# EAGLE design EE192_Sp17_Team01_combo (EAGLE 8.0.1)

## Sheet 1 of 4
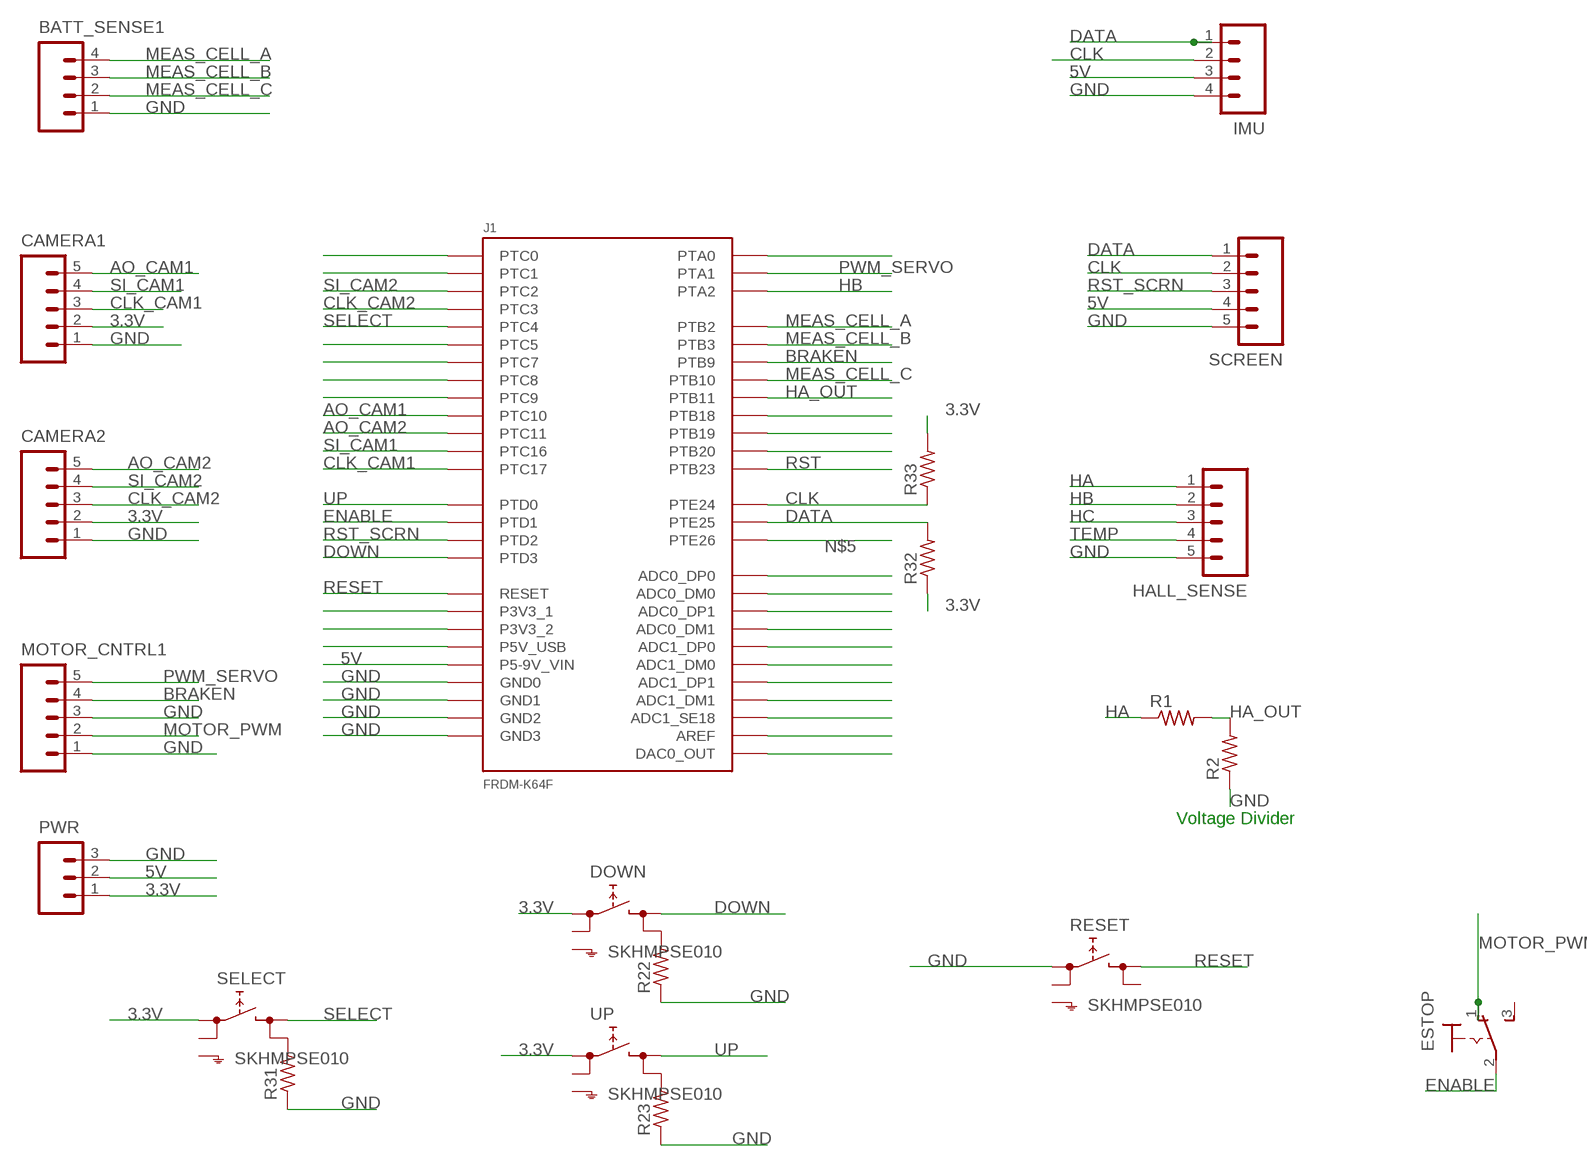
[diagram p0: schematic, sheet 1]

### Parts
BATT_SENSE1  M041X04-MTA  [1X04-MTA]
CAMERA1  M05MTA  [1X05-MTA]
CAMERA2  M05MTA  [1X05-MTA]
DOWN  SKHMPSE010  [SKHMPXE010]
ESTOP  320-916  [320-916]
HALL_SENSE  M05MTA  [1X05-MTA]
IMU  M041X04-MTA  [1X04-MTA]
J1  FRDM-K64F  [FRDM-K64F]
MOTOR_CNTRL1  M05MTA  [1X05-MTA]
PWR  M031X03-MTA  [1X03-MTA]
R1  R-US_R0805  [R0805]
R2  R-US_R0805  [R0805]
R22  R-US_R0805  [R0805]
R23  R-US_R0805  [R0805]
R31  R-US_R0805  [R0805]
R32  R-US_R0805  [R0805]
R33  R-US_R0805  [R0805]
RESET  SKHMPSE010  [SKHMPXE010]
SCREEN  M05MTA  [1X05-MTA]
SELECT  SKHMPSE010  [SKHMPXE010]
UP  SKHMPSE010  [SKHMPXE010]

### Nets
3.3V: CAMERA1.2 CAMERA2.2 DOWN.1(1.1) PWR.1 R32.1 R33.2 SELECT.1(1.1) UP.1(1.1)
5V: IMU.3 J1.J3-16(P5-9V_VIN) PWR.2 SCREEN.4
AO_CAM1: CAMERA1.5 J1.J4-12(PTC10)
AO_CAM2: CAMERA2.5 J1.J4-10(PTC11)
BRAKEN: J1.J1-6(PTB9) MOTOR_CNTRL1.4 ; also sheet 4
CLK: IMU.2 J1.J2-20(PTE24) R33.1 SCREEN.2
CLK_CAM1: CAMERA1.3 J1.J1-4(PTC17)
CLK_CAM2: CAMERA2.3 J1.J1-16(PTC3)
DATA: IMU.1 J1.J2-18(PTE25) R32.2 SCREEN.1
DOWN: DOWN.3(2.1) J1.J2-10(PTD3)
ENABLE: ESTOP.2(P) J1.J2-12(PTD1) ; also sheet 4
GND: BATT_SENSE1.1 CAMERA1.1 CAMERA2.1 HALL_SENSE.5 IMU.4 J1.J2-3(GND0) J1.J2-14(GND1) J1.J3-12(GND2) J1.J3-14(GND3) MOTOR_CNTRL1.1 MOTOR_CNTRL1.3 PWR.3 R2.1 R22.1 R23.1 R31.1 RESET.1(1.1) SCREEN.5 ; also sheet 3,4
HA: HALL_SENSE.1 R1.1 ; also sheet 4
HA_OUT: J1.J4-8(PTB11) R1.2 R2.2
HB: HALL_SENSE.2 J1.J1-12(PTA2) ; also sheet 4
HC: HALL_SENSE.3 ; also sheet 4
MEAS_CELL_A: BATT_SENSE1.4 J1.J4-2(PTB2) ; also sheet 3
MEAS_CELL_B: BATT_SENSE1.3 J1.J4-4(PTB3) ; also sheet 3
MEAS_CELL_C: BATT_SENSE1.2 J1.J4-6(PTB10) ; also sheet 3
MOTOR_PWM: ESTOP.1(O) MOTOR_CNTRL1.2
N$3: J1.J2-7(ADC0_DM0)
N$5: J1.J2-1(PTE26)
N$8: J1.J4-1(ADC0_DP1)
N$9: J1.J1-11(PTC0)
N$11: J1.J1-5(PTC1)
N$15: J1.J1-15(PTC5)
N$16: J1.J1-13(PTC7)
N$17: J1.J1-7(PTC8)
N$18: J1.J1-9(PTC9)
N$19: J1.J2-2(PTA0)
N$20: J1.J1-3(PTB19)
N$21: J1.J3-4(P3V3_1)
N$23: J1.J3-8(P3V3_2)
N$24: J1.J3-10(P5V_USB)
N$25: J1.J4-3(ADC0_DM1)
N$28: J1.J2-11(ADC1_DP0)
N$29: J1.J2-13(ADC1_DM0)
N$30: J1.J4-5(ADC1_DP1)
N$31: J1.J4-7(ADC1_DM1)
N$33: J1.J2-17(ADC1_SE18)
N$34: J1.J2-16(AREF)
N$36: J1.J4-11(DAC0_OUT)
N$37: J1.J4-9(PTB20)
N$41: R31.2 SELECT.4(2.2)
N$42: R23.2 UP.4(2.2)
N$43: DOWN.4(2.2) R22.2
N$44: J1.J2-5(ADC0_DP0)
N$45: J1.J1-1(PTB18)
PWM_SERVO: J1.J1-8(PTA1) MOTOR_CNTRL1.5 ; also sheet 4
RESET: J1.J3-6(RESET) RESET.3(2.1)
RST: J1.J1-10(PTB23)
RST_SCRN: J1.J2-8(PTD2) SCREEN.3
SELECT: J1.J2-4(PTC4) SELECT.3(2.1)
SI_CAM1: CAMERA1.4 J1.J1-2(PTC16)
SI_CAM2: CAMERA2.4 J1.J1-14(PTC2)
TEMP: HALL_SENSE.4 ; also sheet 4
UP: J1.J2-6(PTD0) UP.3(2.1)
Unconnected: DOWN.2(1.2) DOWN.5(SH) ESTOP.3(S) RESET.2(1.2) RESET.4(2.2) RESET.5(SH) SELECT.2(1.2) SELECT.5(SH) UP.2(1.2) UP.5(SH)

### Notes on the sheet
- Voltage Divider

## Sheet 2 of 4

## Sheet 3 of 4
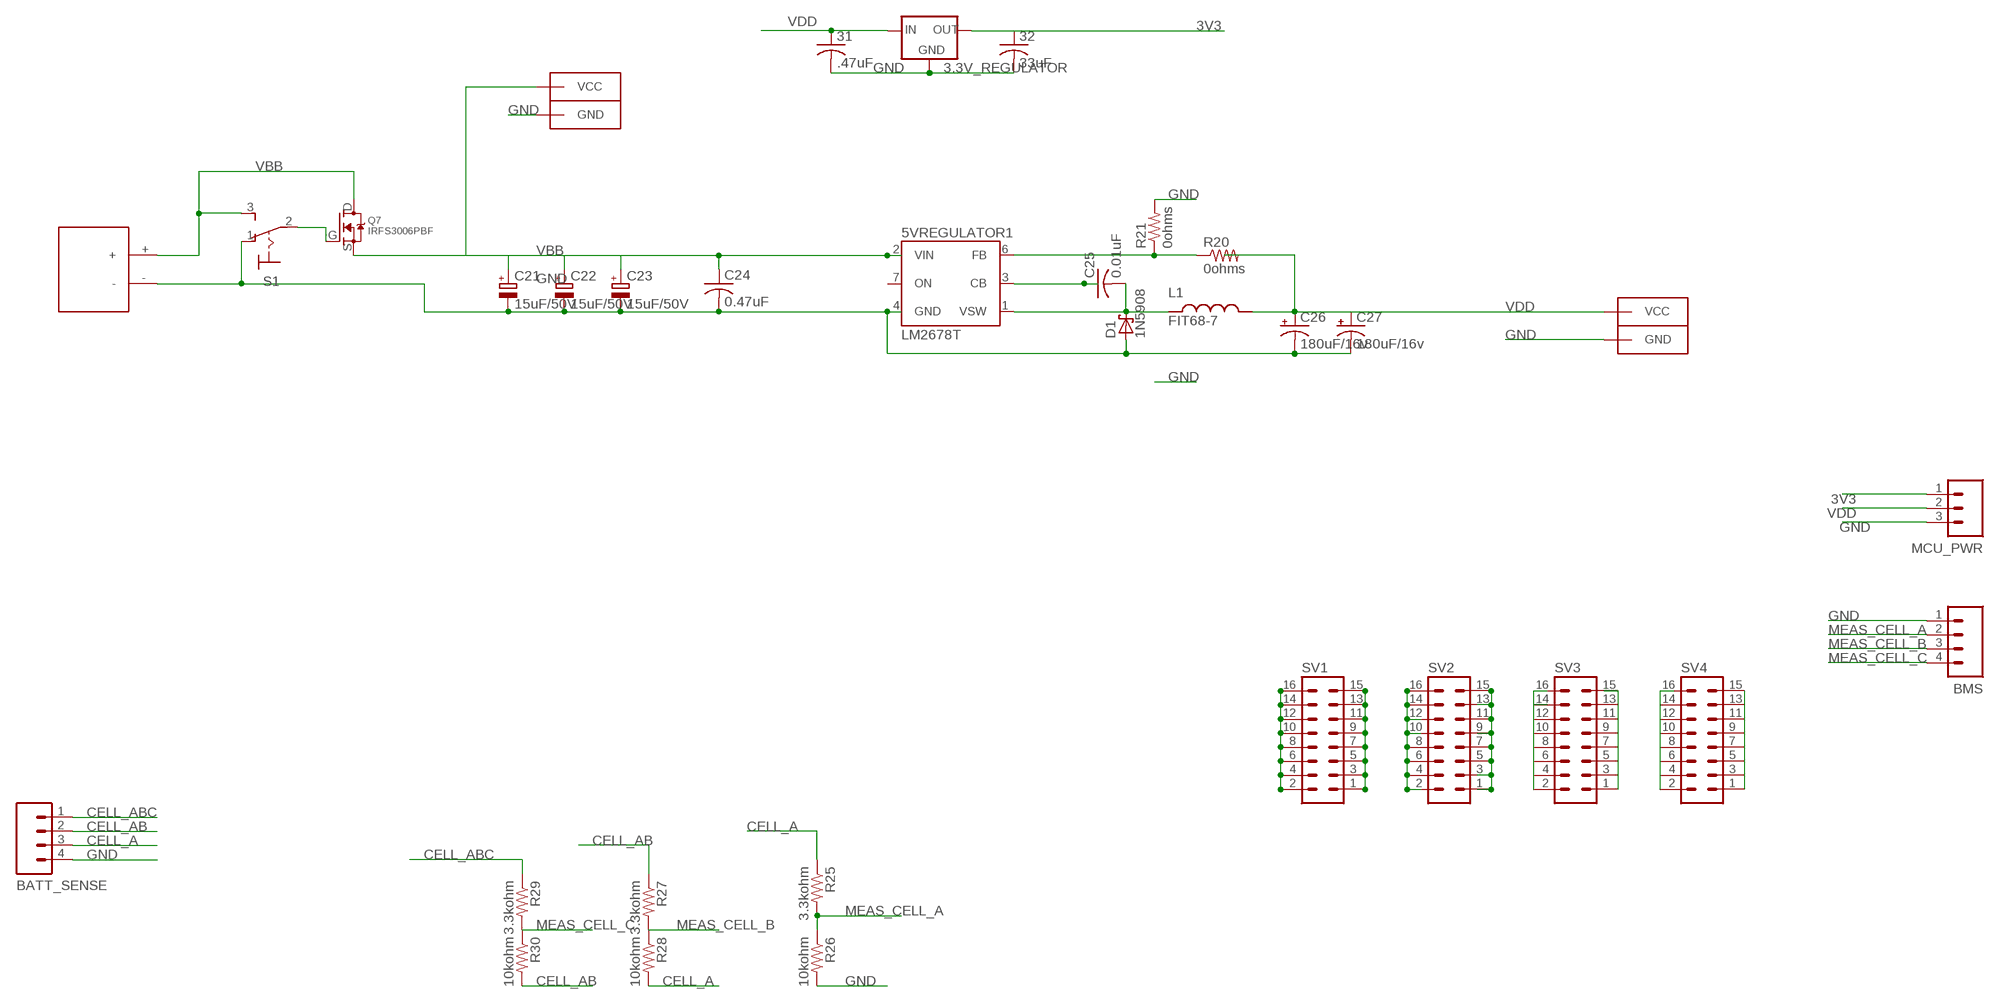
[diagram p1: schematic, sheet 3]

### Parts
3.3V_REGULATOR  78MXXL  [78MXXL]
5VREGULATOR1  LM2678T  [TO220-7]
31  .47uF  C-USC0805  [C0805]
32  33uF  C-USC0805  [C0805]
BATT_SENSE  M041X04-MTA  [1X04-MTA]
BMS  M041X04-MTA  [1X04-MTA]
C21  15uF/50V  CPOL-EUCT7343  [CT7343]
C22  15uF/50V  CPOL-EUCT7343  [CT7343]
C23  15uF/50V  CPOL-EUCT7343  [CT7343]
C24  0.47uF  C-USC0805  [C0805]
C25  0.01uF  C-USC0805  [C0805]
C26  180uF/16v  CPOL-USE3.5-8  [E3,5-8]
C27  180uF/16v  CPOL-USE3.5-8  [E3,5-8]
CONN2  ANDERSON_PP_DOUBLEVERTICAL  [ANDERSON_PP_DOUB_VERT]
D1  1N5908  [C4111-15]
L1  FIT68-7  [FIT68-7]
MCU_PWR  M031X03-MTA  [1X03-MTA]
MOTOR_PWR  ANDERSON_PP_DOUBLEVERTICAL  [ANDERSON_PP_DOUB_VERT]
Q7  IRFS3006PBF  [IRFS3006PBF]
R20  0ohms  R-US_R0805  [R0805]
R21  0ohms  R-US_R0805  [R0805]
R25  3.3kohm  R-US_R0805  [R0805]
R26  10kohm  R-US_R0805  [R0805]
R27  3.3kohm  R-US_R0805  [R0805]
R28  10kohm  R-US_R0805  [R0805]
R29  3.3kohm  R-US_R0805  [R0805]
R30  10kohm  R-US_R0805  [R0805]
S1  320-916  [320-916]
SV1  MA08-2  [MA08-2]
SV2  MA08-2  [MA08-2]
SV3  MA08-2  [MA08-2]
SV4  MA08-2  [MA08-2]
U$5  TAMIYA  [TAMIYA]

### Nets
3V3: 3.3V_REGULATOR.OUT 32.1 MCU_PWR.1
CELL_A: BATT_SENSE.3 R25.1 R28.2
CELL_AB: BATT_SENSE.2 R27.1 R30.2
CELL_ABC: BATT_SENSE.1 R29.1
CONN_15_16: SV4.2 SV4.16
GND: 3.3V_REGULATOR.GND 5VREGULATOR1.4(GND) 31.2 32.2 BATT_SENSE.4 BMS.1 C21.- C22.- C23.- C24.2 C26.- C27.- CONN2.PIN1(GND) D1.A MCU_PWR.3 MOTOR_PWR.PIN1(GND) R21.2 R26.2 S1.1(O) U$5.- ; also sheet 1,4
MEAS_CELL_A: BMS.2 R25.2 R26.1 ; also sheet 1
MEAS_CELL_B: BMS.3 R27.2 R28.1 ; also sheet 1
MEAS_CELL_C: BMS.4 R29.2 R30.1 ; also sheet 1
N$1: 5VREGULATOR1.6(FB) R20.1 R21.1
N$2: SV2.1 SV2.3 SV2.5 SV2.7 SV2.9 SV2.11 SV2.13 SV2.15
N$4: Q7.G S1.2(P)
N$6: SV3.2 SV3.16
N$7: SV3.1 SV3.15
N$10: SV3.14
N$12: 5VREGULATOR1.3(CB) C25.1
N$13: SV2.2 SV2.4 SV2.6 SV2.8 SV2.10 SV2.12 SV2.14 SV2.16
N$22: SV1.2 SV1.4 SV1.6 SV1.8 SV1.10 SV1.12 SV1.14 SV1.16
N$26: SV1.1 SV1.3 SV1.5 SV1.7 SV1.9 SV1.11 SV1.13 SV1.15
N$27: 5VREGULATOR1.1(VSW) C25.2 D1.C L1.P$1
N$32: SV4.1 SV4.15
VBB: 5VREGULATOR1.2(VIN) C21.+ C22.+ C23.+ C24.1 MOTOR_PWR.PIN2(VCC) Q7.D Q7.S S1.3(S) U$5.+ ; also sheet 4
VDD: 3.3V_REGULATOR.IN 31.1 C26.+ C27.+ CONN2.PIN2(VCC) L1.P$2 MCU_PWR.2 R20.2 ; also sheet 4
Unconnected: 5VREGULATOR1.7(ON) SV3.3 SV3.4 SV3.5 SV3.6 SV3.7 SV3.8 SV3.9 SV3.10 SV3.11 SV3.12 SV3.13 SV4.3 SV4.4 SV4.5 SV4.6 SV4.7 SV4.8 SV4.9 SV4.10 SV4.11 SV4.12 SV4.13 SV4.14

## Sheet 4 of 4
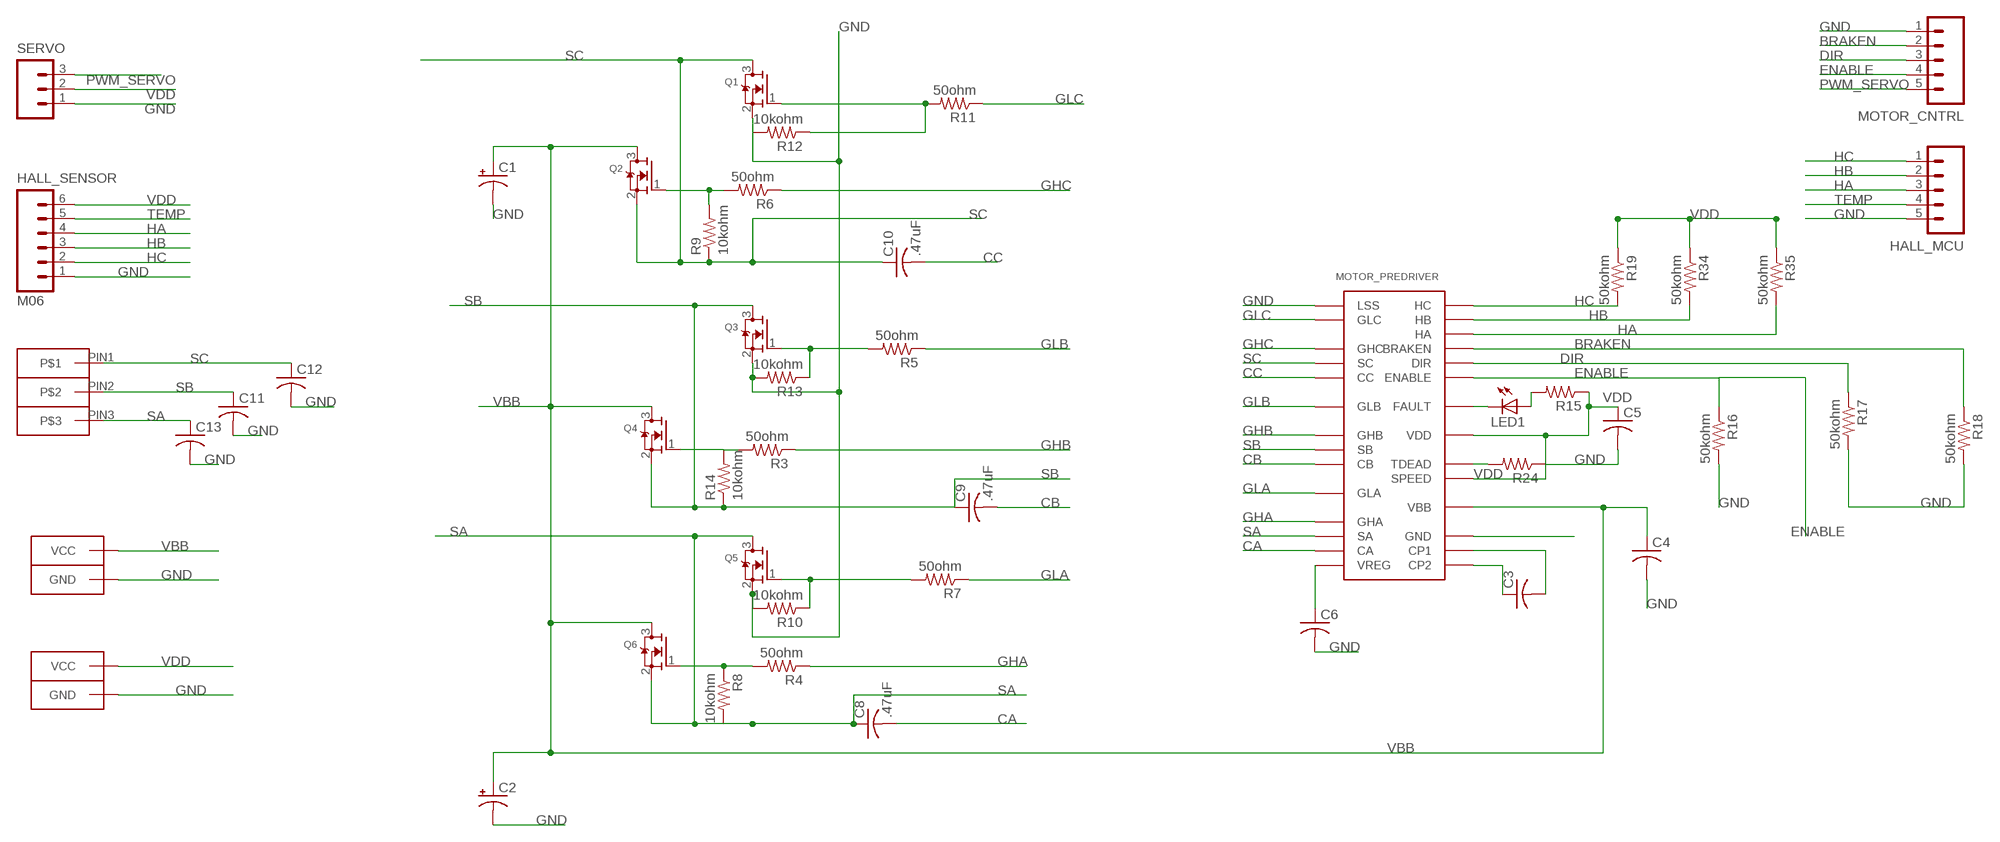
[diagram p2: schematic, sheet 4]

### Parts
C1  CPOL-USE5-10.5  [E5-10,5]
C2  CPOL-USE5-10.5  [E5-10,5]
C3  C-USC0805  [C0805]
C4  C-USC0805  [C0805]
C5  C-USC0805  [C0805]
C6  C-USC0805  [C0805]
C8  .47uF  C-USC0805  [C0805]
C9  .47uF  C-USC0805  [C0805]
C10  .47uF  C-USC0805  [C0805]
C11  C-USC0805  [C0805]
C12  C-USC0805  [C0805]
C13  C-USC0805  [C0805]
CONN1  ANDERSON_PP_DOUBLEVERTICAL  [ANDERSON_PP_DOUB_VERT]
CONN3  ANDERSON_PP_DOUBLEVERTICAL  [ANDERSON_PP_DOUB_VERT]
HALL_MCU  M05MTA  [1X05-MTA]
HALL_SENSOR  M06  [1X06-MTA]
LED1  LEDCHIPLED_0805  [CHIPLED_0805]
MOTOR_CNTRL  M05MTA  [1X05-MTA]
MOTOR_PREDRIVER  A4915SOCKET  [DIL28-6]
MOTOR_PWR1  ANDERSON_PP_TRIPVERT  [ANDERSON_PP_TRIP_VERT]
Q1  IRFS3006PBFTO263PACKAGE  [TO263]
Q2  IRFS3006PBFTO263PACKAGE  [TO263]
Q3  IRFS3006PBFTO263PACKAGE  [TO263]
Q4  IRFS3006PBFTO263PACKAGE  [TO263]
Q5  IRFS3006PBFTO263PACKAGE  [TO263]
Q6  IRFS3006PBFTO263PACKAGE  [TO263]
R3  50ohm  R-US_R0805  [R0805]
R4  50ohm  R-US_R0805  [R0805]
R5  50ohm  R-US_R0805  [R0805]
R6  50ohm  R-US_R0805  [R0805]
R7  50ohm  R-US_R0805  [R0805]
R8  10kohm  R-US_R0805  [R0805]
R9  10kohm  R-US_R0805  [R0805]
R10  10kohm  R-US_R0805  [R0805]
R11  50ohm  R-US_R0805  [R0805]
R12  10kohm  R-US_R0805  [R0805]
R13  10kohm  R-US_R0805  [R0805]
R14  10kohm  R-US_R0805  [R0805]
R15  R-US_R0805  [R0805]
R16  50kohm  R-US_R0805  [R0805]
R17  50kohm  R-US_R0805  [R0805]
R18  50kohm  R-US_R0805  [R0805]
R19  50kohm  R-US_R0805  [R0805]
R24  R-US_R0805  [R0805]
R34  50kohm  R-US_R0805  [R0805]
R35  50kohm  R-US_R0805  [R0805]
SERVO  M031X03-MTA  [1X03-MTA]

### Nets
BRAKEN: MOTOR_CNTRL.2 MOTOR_PREDRIVER.25(BRAKEN) R18.1 ; also sheet 1
CA: C8.2 MOTOR_PREDRIVER.13(CA)
CB: C9.2 MOTOR_PREDRIVER.9(CB)
CC: C10.2 MOTOR_PREDRIVER.5(CC)
DIR: MOTOR_CNTRL.3 MOTOR_PREDRIVER.24(DIR) R17.1
ENABLE: MOTOR_CNTRL.4 MOTOR_PREDRIVER.23(ENABLE) R16.1 ; also sheet 1
GHA: MOTOR_PREDRIVER.11(GHA) R4.1
GHB: MOTOR_PREDRIVER.7(GHB) R3.1
GHC: MOTOR_PREDRIVER.3(GHC) R6.1
GLA: MOTOR_PREDRIVER.10(GLA) R7.1
GLB: MOTOR_PREDRIVER.6(GLB) R5.1
GLC: MOTOR_PREDRIVER.2(GLC) R11.1
GND: C1.- C2.- C4.2 C5.2 C6.2 C11.2 C12.2 C13.2 CONN1.PIN1(GND) CONN3.PIN1(GND) HALL_MCU.5 HALL_SENSOR.1 MOTOR_CNTRL.1 MOTOR_PREDRIVER.1(LSS) Q1.2(S) Q3.2(S) Q5.2(S) R10.2 R12.2 R13.2 R16.2 R17.2 R18.2 R24.1 SERVO.1 ; also sheet 1,3
HA: HALL_MCU.3 HALL_SENSOR.4 MOTOR_PREDRIVER.26(HA) R35.2 ; also sheet 1
HB: HALL_MCU.2 HALL_SENSOR.3 MOTOR_PREDRIVER.27(HB) R34.2 ; also sheet 1
HC: HALL_MCU.1 HALL_SENSOR.2 MOTOR_PREDRIVER.28(HC) R19.2 ; also sheet 1
N$35: C6.1 MOTOR_PREDRIVER.14(VREG)
N$38: Q6.1(G) R4.2 R8.1
N$39: Q2.1(G) R6.2 R9.2
N$40: Q3.1(G) R5.2 R13.1
N$46: Q4.1(G) R3.2 R14.2
N$47: Q5.1(G) R7.2 R10.1
N$48: MOTOR_PREDRIVER.20(TDEAD) R24.2
N$49: C3.1 MOTOR_PREDRIVER.15(CP2)
N$50: C3.2 MOTOR_PREDRIVER.16(CP1)
N$51: MOTOR_PREDRIVER.17(GND)
N$52: Q1.1(G) R11.2 R12.1
N$53: LED1.C MOTOR_PREDRIVER.22(FAULT)
N$54: LED1.A R15.2
PWM_SERVO: MOTOR_CNTRL.5 SERVO.3 ; also sheet 1
SA: C8.1 C13.1 MOTOR_PREDRIVER.12(SA) MOTOR_PWR1.PIN3 Q5.3(D) Q6.2(S) R8.2
SB: C9.1 C11.1 MOTOR_PREDRIVER.8(SB) MOTOR_PWR1.PIN2 Q3.3(D) Q4.2(S) R14.1
SC: C10.1 C12.1 MOTOR_PREDRIVER.4(SC) MOTOR_PWR1.PIN1 Q1.3(D) Q2.2(S) R9.1
TEMP: HALL_MCU.4 HALL_SENSOR.5 ; also sheet 1
VBB: C1.+ C2.+ C4.1 CONN1.PIN2(VCC) MOTOR_PREDRIVER.18(VBB) Q2.3(D) Q4.3(D) Q6.3(D) ; also sheet 3
VDD: C5.1 CONN3.PIN2(VCC) HALL_SENSOR.6 MOTOR_PREDRIVER.19(SPEED) MOTOR_PREDRIVER.21(VDD) R15.1 R19.1 R34.1 R35.1 SERVO.2 ; also sheet 3

## Library data of the parts
3.3V_REGULATOR = v-reg:78MXXL: VOLTAGE REGULATOR
5VREGULATOR1 = v-reg-3:LM2678: National Semiconductor <http://www.national.com> 5.0A "Simple Switcher"(c) 260kHz, Vout 1.2-37V, Vin 40V, 120mOhm DMOS switch, 50µA standby current
31 32 C3-C6 C8-C13 C24 C25 = rcl:C-US: CAPACITOR, American symbol
BATT_SENSE = ee192:M04: 4-pin 0.1-inch header and MTA connector Courtsey of Pioneers in Engineering; PIE-INT-REF-NUM: MTA
BATT_SENSE1 BMS IMU = ee192TomasVersion:M04: 4-pin 0.1-inch header and MTA connector Courtsey of Pioneers in Engineering; PIE-INT-REF-NUM: MTA
C1 C2 C26 C27 = rcl:CPOL-US: POLARIZED CAPACITOR, American symbol
C21-C23 = rcl:CPOL-EU: POLARIZED CAPACITOR, European symbol
CAMERA1 CAMERA2 HALL_MCU HALL_SENSE MOTOR_CNTRL MOTOR_CNTRL1 SCREEN = ee192TomasVersion:M05: 5-pin 0.1-inch header and MTA connector Courtsey of Pioneers in Engineering; PIE-INT-REF-NUM: MTA
CONN1-CONN3 MOTOR_PWR = ee192:ANDERSON_PP_DOUBLE: 2-pin 25A Anderson Connector http://www.alliedelec.com/images/products/datasheets/bm/ANDERSON_POWER_PRODUCTS/70162018.pdf; PIE-INT-REF-NUM: Anderson
D1 = diode:1N5908: DIODE schottky
DOWN RESET SELECT UP = switch:SKHMP*E010: 6.2 X 6.5mm TACT Switch (SMD) Source: http://www3.alps.co.jp/WebObjects/catalog.woa/PDF/E/Switch/Tact/SKHM/SKHM.PDF
ESTOP S1 = switch:320-916: TOGGLE SWITCH distributor RS Components
HALL_SENSOR = ee192TomasVersion:M06: 6-pin 0.1-inch MTA connector Courtsey of Pioneers in Engineering; PIE-INT-REF-NUM: MTA
J1 = ee192TomasVersion:FRDM-K64F: Shield for Freescale Freedom board FRDM-K64F by nathan wong, Team 7 Sp 2016
L1 = ee192TomasVersion:FIT68-7: FIT68-7 Switchmode/High Frequency Toroidal Inductor
LED1 = led:LED: LED OSRAM: - CHIPLED LG R971, LG N971, LY N971, LG Q971, LY Q971, LO R971, LY R971 LH N974, LH R974 LS Q976, LO Q976, LY Q976 LO Q996 - Hyper CHIPLED LW Q18S LB Q993, LB Q99A, LB R99A - SideLED LS A670, LO A670, LY A670, LG A670, LP A670 LB A673, LV A673, LT A673, LW A673 LH A674 LY A675 LS A676, LA A676, LO A676, LY A676, LW A676 LS A679, LY A679, LG A679 - Hyper Micro SIDELED® LS Y876, LA Y876, LO Y876, LY Y876 LT Y87S - SmartLED LW L88C, LW L88S LB L89C, LB L89S, LG L890 LS L89K, LO L89K, LY L89K LS L896, LA L896, LO L896, LY L896 - TOPLED LS T670, LO T670, LY T670, LG T670, LP T670 LSG T670, LSP T670, LSY T670, LOP T670, LYG T670 LG T671, LOG T671, LSG T671 LB T673, LV T673, LT T673, LW T673 LH T674 LS T676, LA T676, LO T676, LY T676, LB T676, LH T676, LSB T676, LW T676 LB T67C, LV T67C, LT T67C, LS T67K, LO T67K, LY T67K, LW E67C LS E67B, LA E67B, LO E67B, LY E67B, LB E67C, LV E67C, LT E67C LW T67C LS T679, LY T679, LG T679 LS T770, LO T770, LY T770, LG T770, LP T770 LB T773, LV T773, LT T773, LW T773 LH T774 LS E675, LA E675, LY E675, LS T675 LS T776, LA T776, LO T776, LY T776, LB T776 LHGB T686 LT T68C, LB T68C - Hyper Mini TOPLED® LB M676 - Mini TOPLED Santana® LG M470 LS M47K, LO M47K, LY M47K Source: http://www.osram.convergy.de LUXEON: - LUMILED® LXK2-PW12-R00, LXK2-PW12-S00, LXK2-PW14-U00, LXK2-PW14-V00 LXK2-PM12-R00, LXK2-PM12-S00, LXK2-PM14-U00 LXK2-PE12-Q00, LXK2-PE12-R00, LXK2-PE12-S00, LXK2-PE14-T00, LXK2-PE14-U00 LXK2-PB12-K00, LXK2-PB12-L00, LXK2-PB12-M00, LXK2-PB14-N00, LXK2-PB14-P00, LXK2-PB14-Q00 LXK2-PR12-L00, LXK2-PR12-M00, LXK2-PR14-Q00, LXK2-PR14-R00 LXK2-PD12-Q00, LXK2-PD12-R00, LXK2-PD12-S00 LXK2-PH12-R00, LXK2-PH12-S00 LXK2-PL12-P00, LXK2-PL12-Q00, LXK2-PL12-R00 Source: www.luxeon.com KINGBRIGHT: KA-3528ASYC Source: www.kingbright.com
MCU_PWR = ee192:M03: 3-pin 0.1-inch header and MTA connector Courtsey of Pioneers in Engineering; PIE-INT-REF-NUM: MTA
MOTOR_PREDRIVER = ee192-motor-driver:A4915: 3-Phase MOSFET Driver
MOTOR_PWR1 = ee192:ANDERSON_PP_TRIP: 3-pin 25A Anderson Connector http://www.alliedelec.com/images/products/datasheets/bm/ANDERSON_POWER_PRODUCTS/70162018.pdf
PWR SERVO = ee192TomasVersion:M03: 3-pin 0.1-inch header and MTA connector Courtsey of Pioneers in Engineering; PIE-INT-REF-NUM: MTA
Q1-Q6 = ee192:IRFS3006PBF
Q7 = ee192TomasVersion:IRFS3006PBF
R1 R2 R20 R21 = resistor:R-US_: RESISTOR, American symbol
R3-R19 R22-R35 = rcl:R-US_: RESISTOR, American symbol
SV1-SV4 = con-lstb:MA08-2: PIN HEADER; OC_FARNELL: unknown; OC_NEWARK: unknown
U$5 = ee192:TAMIYA: Wires to Tamiya Battery connector

## Board
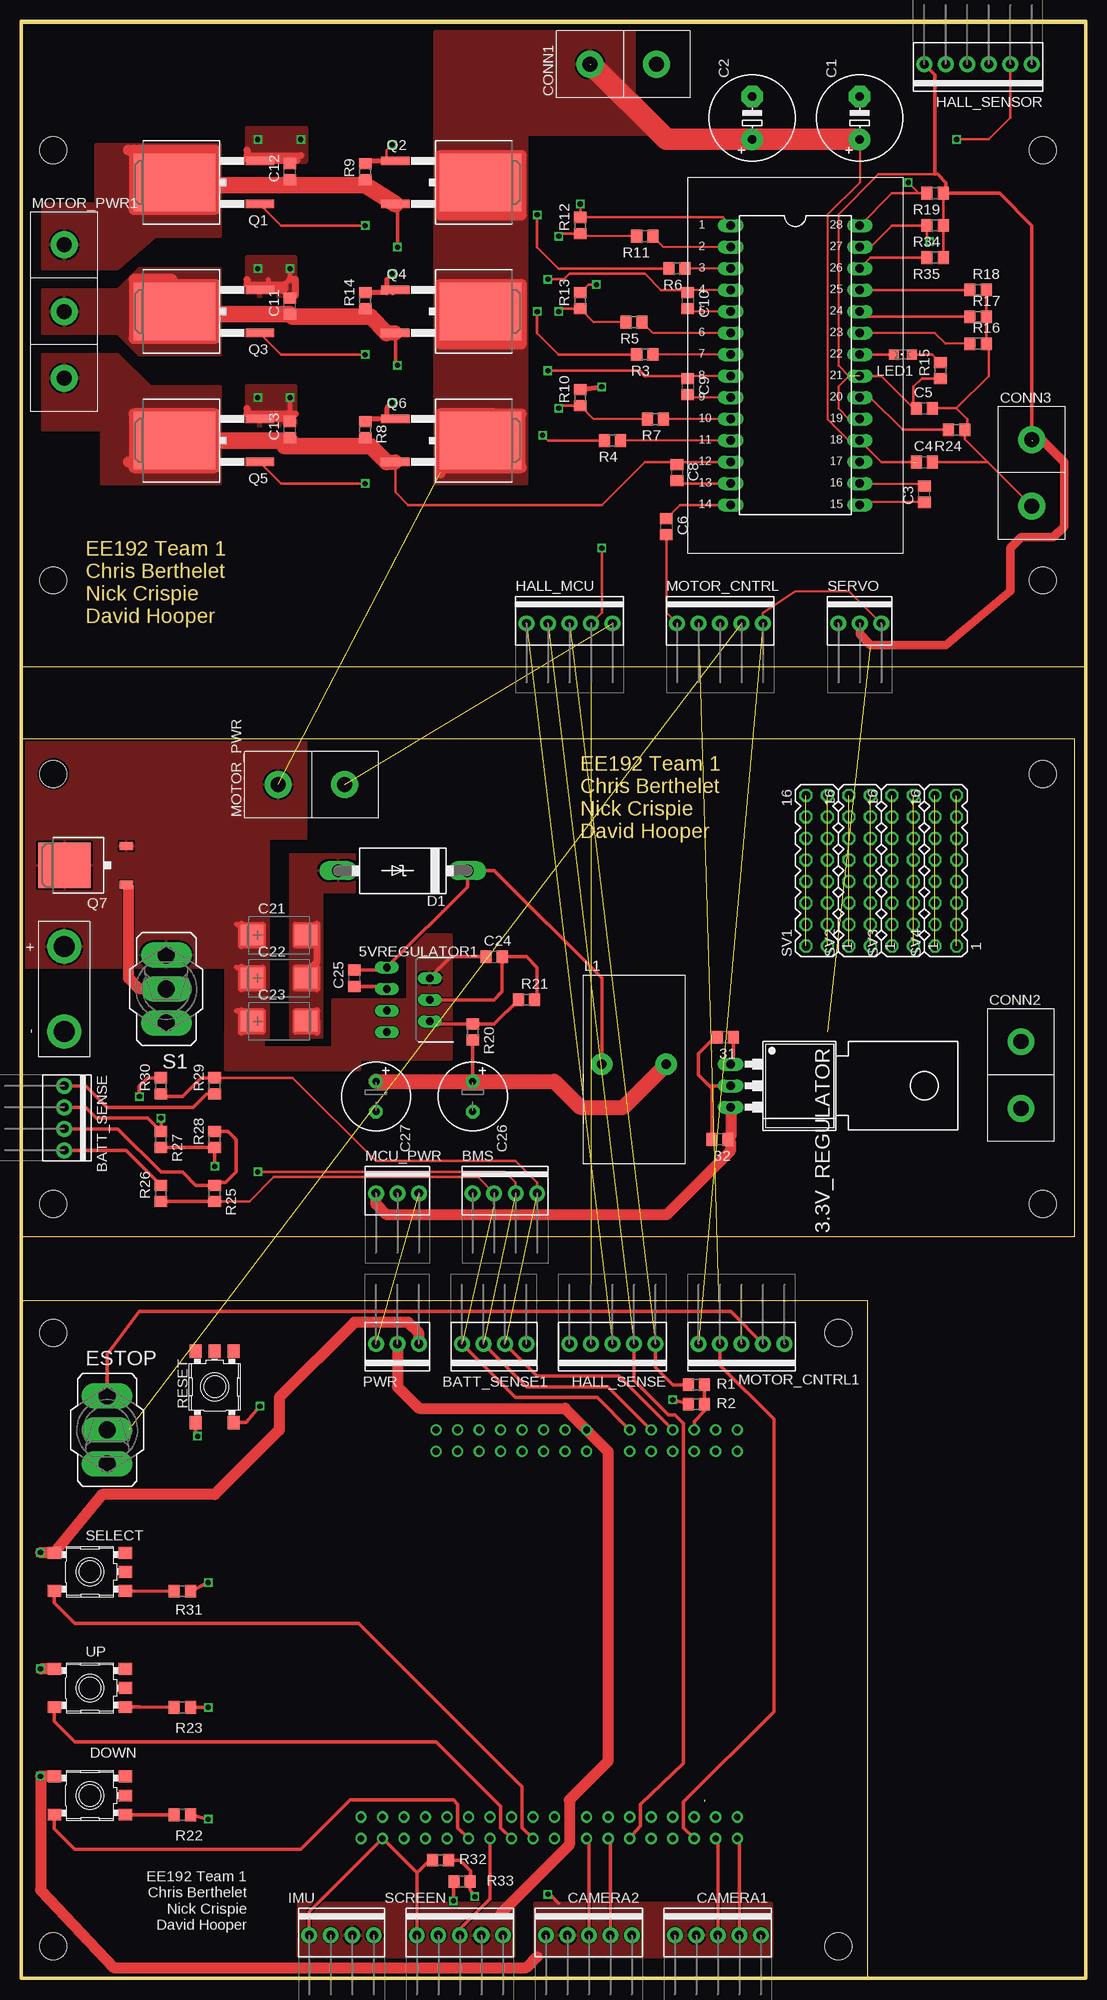
[diagram p3: board, top side]
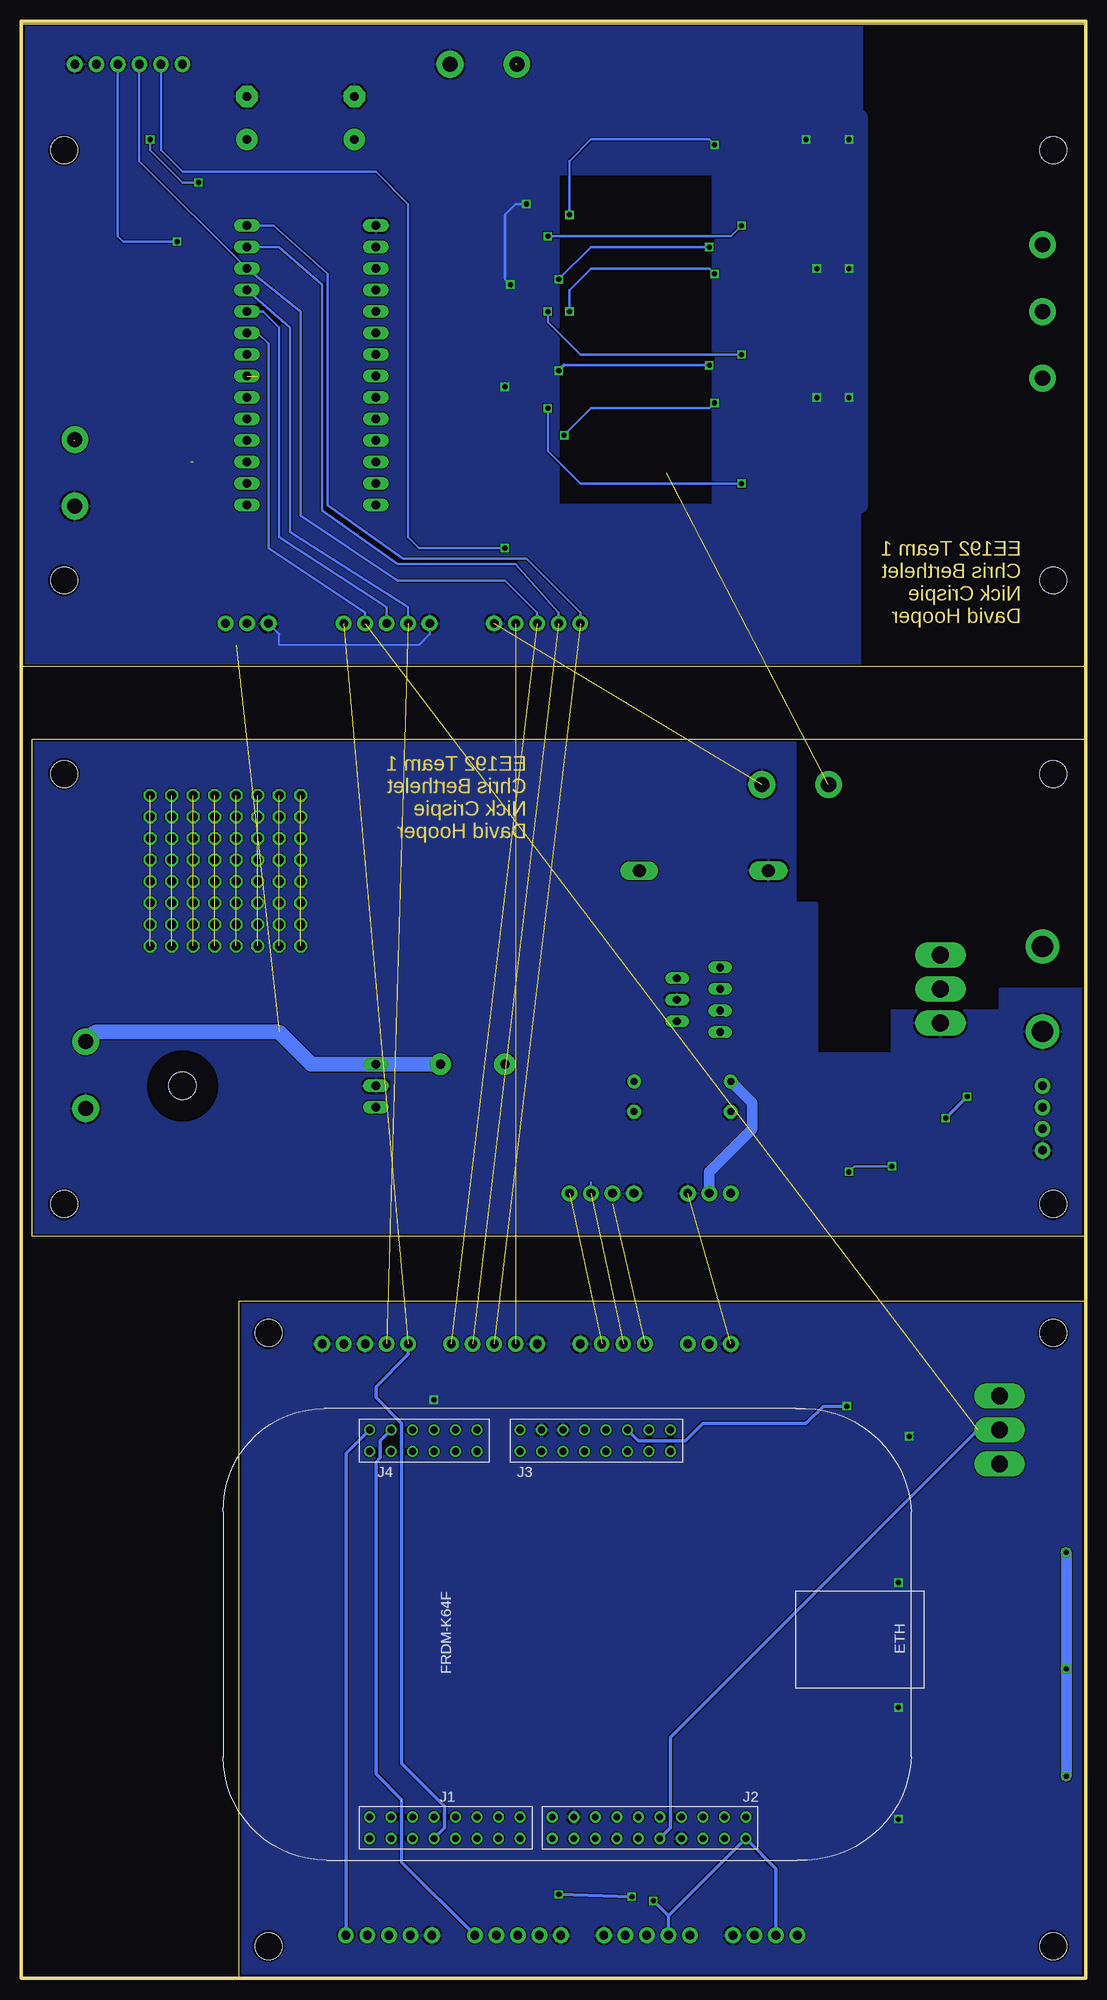
[diagram p4: board, bottom side, seen from below]

Size 125.73 x 231.14 mm. Coordinates in mm from the lower left corner, seen from the top.
Outline: 0,0 100,0 100,80 0,80 0,0
Outline: 0,0 0,231.14 125.73,231.14 125.73,0 0,0
Outline: 0,87.63 124.44,87.63 124.44,146.35 0,146.35 0,87.63
Outline: 0,154.94 125.71,154.94 125.71,230.81 0,230.81 0,154.94
Copper layers (1*16): Top 0.035mm / dielectric 1.5mm / Bottom 0.035mm
Design rules "BAC_Rules": minimum track width 10mil, minimum drill 10mil, track to track 5mil, track to pad 8mil, pad to pad 8mil, via to via 8mil, smd to smd 8mil, copper to edge 10mil, drill to drill 8mil, minimum pad ring 10mil, minimum via ring 8mil, stop-mask expansion 4mil, vias tented up to drill 0mil, thermal gap 10mil
Holes 3.2 mm at 3.81,3.81 96.52,3.81 96.52,76.2 3.81,76.2 3.81,91.44 3.81,142.24 120.65,142.24 120.65,91.44 3.81,165.1 3.81,215.9 120.65,215.9 120.65,165.1

### Footprints (pad centres in the part's own frame; a part is rotated, then mirrored left to right if it is on the bottom)
78MXXL = drill 1.016 long: GND 0,-5.08; IN -2.54,-5.08; OUT 2.54,-5.08 | hole 3.302: 0,17.78
TO220-7 = drill 0.9 long: 1 -3.81,-5.08; 2 -2.54,0; 3 -1.27,-5.08; 4 0,0; 5 1.27,-5.08; 6 2.54,0; 7 3.81,-5.08
C0805 = smd 1.3 x 1.5: 1 -0.95,0; 2 0.95,0
1X04-MTA = drill 1.016 pad 1.88: 1 -3.81,0; 2 -1.27,0; 3 1.27,0; 4 3.81,0
E5-10,5 = drill 1.016 pad 2.54: + -2.54,0 | drill 1.016 pad 2.54 octagon: - 2.54,0
CT7343 = smd 2.6 x 2.4: + -3.2,0; - 3.2,0
E3,5-8 = drill 0.813 pad 1.6: + -1.778,0 | drill 0.813 pad 1.6 octagon: - 1.778,0
1X05-MTA = drill 1.016 pad 1.88: 1 -5.08,0; 2 -2.54,0; 3 0,0; 4 2.54,0; 5 5.08,0
ANDERSON_PP_DOUB_VERT = drill 1.778 pad 3.175: PIN1 0,-3.937; PIN2 0,3.937
C4111-15 = drill 1.499 long: A 7.62,0; C -7.62,0
SKHMPXE010 = smd 1.6 x 1.4: 1 -4.2,2.25; 2 4.2,2.25; 3 -4.2,-2.25; 4 4.2,-2.25; 5 4.2,0
320-916 = drill 2.007 long: 1 0,4.013; 2 0,0; 3 0,-4.013
1X06-MTA = drill 1.016 pad 1.88: 1 -6.35,0; 2 -3.81,0; 3 -1.27,0; 4 1.27,0; 5 3.81,0; 6 6.35,0
FRDM-K64F = drill 0.8: J1-1 23.622,21.59; J1-2 23.622,24.13; J1-3 21.082,21.59; J1-4 21.082,24.13; J1-5 18.542,21.59; J1-6 18.542,24.13; J1-7 16.002,21.59; J1-8 16.002,24.13; J1-9 13.462,21.59; J1-10 13.462,24.13; J1-11 10.922,21.59; J1-12 10.922,24.13; J1-13 8.382,21.59; J1-14 8.382,24.13; J1-15 5.842,21.59; J1-16 5.842,24.13; J2-1 2.032,21.59; J2-2 2.032,24.13; J2-3 -0.508,21.59; J2-4 -0.508,24.13; J2-5 -3.048,21.59; J2-6 -3.048,24.13; J2-7 -5.588,21.59; J2-8 -5.588,24.13; J2-9 -8.128,21.59; J2-10 -8.128,24.13; J2-11 -10.668,21.59; J2-12 -10.668,24.13; J2-13 -13.208,21.59; J2-14 -13.208,24.13; J2-15 -15.748,21.59; J2-16 -15.748,24.13; J2-17 -18.288,21.59; J2-18 -18.288,24.13; J2-19 -20.828,21.59; J2-20 -20.828,24.13; J3-1 -11.938,-21.59; J3-2 -11.938,-24.13; J3-3 -9.398,-21.59; J3-4 -9.398,-24.13; J3-5 -6.858,-21.59; J3-6 -6.858,-24.13; J3-7 -4.318,-21.59; J3-8 -4.318,-24.13; J3-9 -1.778,-21.59; J3-10 -1.778,-24.13; J3-11 0.762,-21.59; J3-12 0.762,-24.13; J3-13 3.302,-21.59; J3-14 3.302,-24.13; J3-15 5.842,-21.59; J3-16 5.842,-24.13; J4-1 10.922,-21.59; J4-2 10.922,-24.13; J4-3 13.462,-21.59; J4-4 13.462,-24.13; J4-5 16.002,-21.59; J4-6 16.002,-24.13; J4-7 18.542,-21.59; J4-8 18.542,-24.13; J4-9 21.082,-21.59; J4-10 21.082,-24.13; J4-11 23.622,-21.59; J4-12 23.622,-24.13
FIT68-7 = drill 1.1 pad 2.54: P$1 -3.81,0; P$2 3.81,0
CHIPLED_0805 = smd 1.2 x 1.2: A 0,-1.05; C 0,1.05
1X03-MTA = drill 1.016 pad 1.88: 1 -2.54,0; 2 0,0; 3 2.54,0
DIL28-6 = drill 1 long: 1 -16.51,-7.62; 2 -13.97,-7.62; 3 -11.43,-7.62; 4 -8.89,-7.62; 5 -6.35,-7.62; 6 -3.81,-7.62; 7 -1.27,-7.62; 8 1.27,-7.62; 9 3.81,-7.62; 10 6.35,-7.62; 11 8.89,-7.62; 12 11.43,-7.62; 13 13.97,-7.62; 14 16.51,-7.62; 15 16.51,7.62; 16 13.97,7.62; 17 11.43,7.62; 18 8.89,7.62; 19 6.35,7.62; 20 3.81,7.62; 21 1.27,7.62; 22 -1.27,7.62; 23 -3.81,7.62; 24 -6.35,7.62; 25 -8.89,7.62; 26 -11.43,7.62; 27 -13.97,7.62; 28 -16.51,7.62
ANDERSON_PP_TRIP_VERT = drill 1.778 pad 3.175: PIN1 0,7.874; PIN2 0,0; PIN3 0,-7.874
TO263 = smd 1 x 3.4: 1 -2.54,-6.6; 2 2.54,-6.6 | smd 6.8 x 9.6: 3 0,3.5
IRFS3006PBF = smd 5.4 x 6.2: D 0,1.23 | smd 1 x 1.6: G -2.28,-6.07; S 2.28,-6.07
R0805 = smd 1.3 x 1.5: 1 -0.95,0; 2 0.95,0
MA08-2 = drill 1.016 octagon: 1 -8.89,-1.27; 2 -8.89,1.27; 3 -6.35,-1.27; 4 -6.35,1.27; 5 -3.81,-1.27; 6 -3.81,1.27; 7 -1.27,-1.27; 8 -1.27,1.27; 9 1.27,-1.27; 10 1.27,1.27; 11 3.81,-1.27; 12 3.81,1.27; 13 6.35,-1.27; 14 6.35,1.27; 15 8.89,-1.27; 16 8.89,1.27
TAMIYA = drill 2.5 pad 4: + -5,0; - 5,0

### Placement (x,y rotation side)
3.3V_REGULATOR  88.9,105.41 270 top
5VREGULATOR1  48.26,115.57 270 top
31  83.19,111.12 180 top
32  82.55,99.06 180 top
BATT_SENSE  5.08,101.6 270 top
BATT_SENSE1  55.88,74.93 180 top
BMS  57.15,92.71 0 top
C1  99.06,219.71 90 top
C2  86.36,219.71 90 top
C3  106.68,175.26 90 top
C4  106.68,179.07 0 top
C5  106.68,185.42 0 top
C6  76.2,171.45 270 top
C8  77.47,177.8 270 top
C9  78.74,187.96 270 top
C10  78.74,198.12 270 top
C11  31.75,197.49 90 top
C12  31.75,213.36 90 top
C13  31.75,182.88 90 top
C21  30.48,123.19 0 top
C22  30.48,118.11 0 top
C23  30.48,113.03 0 top
C24  55.88,120.65 0 top
C25  39.37,118.11 90 top
C26  53.34,104.14 270 top
C27  41.91,104.14 270 top
CAMERA1  82.3,5.08 0 top
CAMERA2  67.06,5.08 0 top
CONN1  71.12,226.06 90 top
CONN2  118.11,106.68 0 top
CONN3  119.38,177.8 0 top
D1  45.09,130.81 180 top
DOWN  8.13,21.59 0 top
ESTOP  10.16,64.77 0 top
HALL_MCU  64.77,160.02 0 top
HALL_SENSE  69.85,74.93 180 top
HALL_SENSOR  113.03,226.06 180 top
IMU  37.85,5.08 0 top
J1  60.96,40.64 180 bottom
L1  72.39,107.95 0 top
LED1  104.14,191.77 90 top
MCU_PWR  44.45,92.71 0 top
MOTOR_CNTRL  82.55,160.02 0 top
MOTOR_CNTRL1  85.09,74.93 180 top
MOTOR_PREDRIVER  91.44,190.5 270 top
MOTOR_PWR  34.29,140.97 90 top
MOTOR_PWR1  5.08,196.85 0 top
PWR  44.45,74.93 180 top
Q1  21.59,212.09 90 top
Q2  50.8,212.09 270 top
Q3  21.59,196.85 90 top
Q4  50.8,196.85 270 top
Q5  21.59,181.61 90 top
Q6  50.8,181.61 270 top
Q7  6.35,131.44 90 top
R1  79.76,70.1 0 top
R2  79.76,67.82 0 top
R3  73.66,191.77 180 top
R4  69.85,181.61 180 top
R5  72.39,195.58 180 top
R6  77.47,201.93 180 top
R7  74.93,184.15 180 top
R8  40.64,182.88 270 top
R9  40.64,213.36 90 top
R10  66.04,186.69 90 top
R11  73.66,205.74 180 top
R12  66.04,207.01 90 top
R13  66.04,198.12 90 top
R14  40.64,198.12 90 top
R15  108.58,189.87 90 top
R16  113.03,193.04 0 top
R17  113.03,196.22 0 top
R18  113.03,199.39 0 top
R19  107.95,210.82 180 top
R20  53.34,111.76 270 top
R21  59.69,115.57 0 top
R22  19.05,19.3 180 top
R23  19.05,32 180 top
R24  110.49,182.88 180 top
R25  22.86,92.71 270 top
R26  16.51,92.71 90 top
R27  16.51,99.06 270 top
R28  22.86,99.06 90 top
R29  22.86,105.41 90 top
R30  16.51,105.41 90 top
R31  19.05,45.72 180 top
R32  49.53,13.97 180 top
R33  52.07,11.43 0 top
R34  107.95,207.01 180 top
R35  107.95,203.2 180 top
RESET  22.86,69.85 90 top
S1  17.14,116.84 180 top
SCREEN  51.82,5.08 0 top
SELECT  8.13,48.01 0 top
SERVO  99.06,160.02 0 top
SV1  93.98,130.81 90 top
SV2  99.06,130.81 90 top
SV3  104.14,130.81 90 top
SV4  109.22,130.81 90 top
U$5  5.08,116.84 270 top
UP  8.13,34.29 0 top

### Tracks (layer width: path | path; a pad name or v marks a point on that pad's centre or on a via)
3.3V  (via drill 0.6)
  Top 0.406: R32.1 51.82,13.97 53.09,12.7 53.09,11.5 R33.2 53.02,10.48 v53.59,9.65 | v62.23,9.91 62.48,9.91 63.5,8.89 | 2.29,50.26 v2.29,50.29 | 2.32,36.54 v2.29,36.58 | DOWN.1 3.93,23.88
  Top 1.27: PWR.1 46.99,76.2 45.72,77.47 39.37,77.47 30.48,68.58 30.48,64.77 22.86,57.15 9.55,57.15 SELECT.1 2.29,50.26 | 60.96,2.54 59.69,1.27 10.92,1.27 2.29,10.41 v2.29,23.88 3.93,23.88 | UP.1 2.32,36.54
  Bottom 0.406: v53.59,9.65 v62.23,9.91
  Bottom 1.27: v2.29,50.29 v2.29,36.58 v2.29,23.88
  pour Top: 60.71,2.54 60.71,8.89 88.65,8.89 88.65,2.54
3V3
  Top 0.406: 32.1 83.82,99.38
  Top 0.813: 83.82,98.74 32.1
  Top 1.27: 3.3V_REGULATOR.OUT 83.82,99.38 | 83.82,98.74 83.82,97.79 76.2,90.17 43.18,90.17 41.91,91.44 MCU_PWR.1
5V
  Top 1.27: PWR.2 44.45,69.85 46.99,67.31 64.26,67.31 J1.J3-16 69.34,62.23 69.34,25.65 64.77,21.08 64.77,15.75 56.64,7.62
  pour Top: 32.77,8.89 32.77,2.54 58.17,2.54 58.17,8.89
AO_CAM1
  Bottom 0.406: CAMERA1.5 87.38,61.98 J1.J4-12
AO_CAM2  (1 unrouted)
  Bottom 0.406: CAMERA2.5 80.77,13.72 80.77,20.83 | 80.77,20.32 80.77,21.08 83.82,24.13 83.82,60.96 83.31,61.47 83.31,63.5 J1.J4-10
BRAKEN  (1 unrouted)
  Top 0.305: MOTOR_PREDRIVER.25 R18.1
  Top 0.406: MOTOR_CNTRL1.4 82.55,72.39 88.9,66.04 88.9,31.5 78.23,20.83 78.23,17.78 J1.J1-6
  Bottom 0.305: MOTOR_CNTRL.2 80.01,161.93 93.98,170.81 93.98,194.94 MOTOR_PREDRIVER.25
CA
  Top 0.254: 77.79,176.53 C8.2
  Top 0.305: MOTOR_PREDRIVER.13 77.79,176.53
CB
  Top 0.254: MOTOR_PREDRIVER.9 79.06,186.69 C9.2
CC
  Top 0.254: MOTOR_PREDRIVER.5 79.06,196.85 C10.2
CELL_A
  Top 0.406: BATT_SENSE.3 11.43,100.33 16.51,95.25 19.05,95.25 20.64,93.66 R25.1 23.18,93.98 24.13,93.98 25.4,95.25 25.4,99.06 24.45,100.01 R28.2
CELL_AB  (via drill 0.6)
  Top 0.406: BATT_SENSE.2 7.62,102.87 8.89,101.6 14.92,101.6 R27.1 v16.51,101.6 | R30.2 14.92,106.36 13.97,105.41 v13.97,104.14
  Bottom 0.406: v13.97,104.14 v16.51,101.6
CELL_ABC
  Top 0.406: R29.1 21.91,104.46 20.32,102.87 10.16,102.87 7.62,105.41 BATT_SENSE.1
CLK  (via drill 0.6)
  Top 0.406: v51.05,9.14 51.05,11.36 R33.1
  Bottom 0.406: SCREEN.2 49.28,7.37 | 49.28,7.37 J1.J2-20 36.58,12.95 IMU.2 | 49.28,7.37 v51.05,9.14
CLK_CAM1
  Top 0.406: CAMERA1.3 82.3,16.26 J1.J1-4
CLK_CAM2
  Top 0.406: CAMERA2.3 67.06,16.26 J1.J1-16
CONN_15_16  (1 unrouted)
DATA
  Top 0.406: IMU.1 34.04,7.87 J1.J2-18 46.74,12.45 | 46.74,12.45 SCREEN.1 | R32.2 48.26,13.97 46.74,12.45
DIR
  Top 0.254: 99.69,196.22 MOTOR_PREDRIVER.24
  Top 0.305: R17.1 99.69,196.22
  Bottom 0.305: MOTOR_CNTRL.3 82.55,161.93 84.45,163.19 95.25,170.18 95.25,194.94 97.16,196.85 MOTOR_PREDRIVER.24
DOWN
  Top 0.406: DOWN.3 3.93,17.66 6.35,15.24 33.02,15.24 38.86,21.08 51.05,21.08 51.56,20.57 51.56,17.78 J1.J2-10
ENABLE  (1 unrouted)
  Top 0.254: R16.1 109.22,193.04 107.95,194.31 MOTOR_PREDRIVER.23
  Bottom 0.305: MOTOR_CNTRL.4 85.09,161.29 96.52,168.91 96.52,193.04 97.79,194.31 MOTOR_PREDRIVER.23
  Bottom 0.406: ESTOP.2 12.7,64.77 49.02,28.45 49.02,17.78 J1.J2-12
GHA
  Top 0.254: MOTOR_PREDRIVER.11 R4.1
GHB
  Top 0.254: MOTOR_PREDRIVER.7 R3.1
GHC
  Top 0.254: MOTOR_PREDRIVER.3 R6.1
GLA
  Top 0.254: MOTOR_PREDRIVER.10 R7.1
GLB
  Top 0.254: MOTOR_PREDRIVER.6 74.61,194.31 R5.1
GLC
  Top 0.254: MOTOR_PREDRIVER.2 75.88,204.47 R11.1
GND  (via drill 0.6)  (2 unrouted)
  Top 0.305: R18.2 R17.2 R16.2 | C6.2 76.2,161.29 MOTOR_CNTRL.1 | R13.2 67,200.03 v67.94,200.03 | 114.17,179.07 C4.2 | 114.17,179.07 CONN3.PIN1 | C5.2 110.49,185.42 | 110.49,185.42 111.76,184.15 111.76,183.2 | 110.49,185.42 114.3,189.23 114.3,192.72 | R24.1 111.44,181.8 114.17,179.07 | MOTOR_PREDRIVER.1 82.87,207.96 R12.2 v66.04,209.55
  Top 0.406: R22.1 v22.1,18.8 | R31.1 v22.1,46.74 | RESET.1 20.61,64.23 v20.83,64.01 | R2.1 v76.96,68.33 | R23.1 v22.1,32 | R21.2 60.96,115.89 60.96,119.38 59.69,120.65 C24.2 56.83,116.52 55.88,115.57 5VREGULATOR1.4 | 31.2 81.92,111.12 80.01,109.22 80.01,106.68 81.28,105.41 | 81.28,105.41 3.3V_REGULATOR.GND | 32.2 81.6,105.09 81.28,105.41 | BATT_SENSE.4 12.38,97.79 R26.2 | 111.76,183.2 R24.1 | 114.3,192.72 R16.2
  Top 0.61: 34.92,124.46 32.38,124.46 32.38,121.92 34.92,121.92 | 34.92,119.38 34.29,119.38 32.38,119.38 32.38,116.84 34.92,116.84 | 34.92,114.3 32.38,114.3 32.38,111.76 34.92,111.76 | Q3.2 29.21,199.39 | 29.21,199.39 30.48,199.39 | 30.48,199.39 30.8,199.39 C11.2 | Q1.2 29.84,214.63 | 29.84,214.63 32.7,214.63 C12.2 | Q5.2 31.43,184.15 C13.2 v31.75,186.69 | 30.48,199.39 31.75,200.66 v31.75,201.93 | 29.21,199.39 29.21,200.66 | 26.67,214.63 26.67,215.26 | 29.84,214.63 29.84,215.26 | R10.2 v68.58,187.96
  Top 0.813: 34.92,119.38 34.92,116.84 | 34.92,113.03 34.92,114.3 | 34.92,113.03 34.92,111.76 | C21.- 33.68,123.22 34.92,124.46 34.92,121.92 34.92,120.02 34.29,119.38 | C23.- 34.92,113.03 | 26.67,215.9 26.67,215.26 33.02,215.26 | 26.67,200.66 26.67,200.03 31.11,200.03 31.11,199.39 29.21,199.39 | 31.75,200.66 32.38,200.66 32.38,198.75 | 26.67,185.42 26.67,184.78 32.38,184.78
  Bottom 0.254: MOTOR_CNTRL.1 77.47,158.75 78.74,157.48 95.25,157.48 95.25,158.75 SERVO.1
  Bottom 0.305: v66.04,209.55 67.31,209.55 68.58,208.28 68.58,200.66 v67.94,200.03
  other vias: 33.02,217.17 27.94,217.17 27.94,201.93 27.94,186.69
  pour Bottom: 0,80.01 100.33,80.01 100.33,0 0,0
  pour Bottom: -5.08,116.84 10.16,116.84 10.16,114.3 22.86,114.3 22.86,109.22 31.75,109.22 31.75,127 34.29,127 34.29,138.43 34.29,148.59 125.73,148.59 125.73,83.82 -5.08,83.82
  pour Top: 39.37,128.27 39.37,132.72 31.75,132.72 31.75,111.12 35.56,111.12 35.56,128.27
  pour Bottom: 128.27,232.41 72.39,232.41 72.39,213.36 62.23,213.36 62.23,173.99 26.67,173.99 26.67,151.13 130.81,151.13 128.27,153.67
  pour Bottom: 43.18,220.98 29.21,220.98 26.67,219.71 26.67,173.99 30.48,171.45 43.18,171.45
  pour Top: 33.66,218.44 26.67,218.44 26.67,214.63 33.66,214.63
  pour Top: 32.38,203.2 26.67,203.2 26.67,198.75 32.38,198.75
  pour Top: 31.75,187.96 26.67,187.96 26.67,184.15 27.3,183.51 32.38,183.51 32.38,187.96
  pour Bottom: 26.67,219.71 26.67,234.95 72.39,234.95 72.39,233.68 72.39,213.36 26.67,213.36
HA  (1 unrouted)
  Top 0.305: MOTOR_PREDRIVER.26 100.33,203.2 R35.2
  Top 0.406: HALL_SENSE.1 74.93,72.14 76.96,70.1 R1.1
  Bottom 0.305: HALL_MCU.3 64.77,161.29 68.58,165.1 81.28,165.1 92.71,172.72 92.71,196.85 MOTOR_PREDRIVER.26 111.76,214.63 HALL_SENSOR.4
HA_OUT
  Top 0.406: R1.2 R2.2 80.71,66.99 79.5,65.79 J1.J4-8
HB  (via drill 0.6)  (1 unrouted)
  Top 0.305: 100.33,204.47 102.87,207.01 R34.2 107,205.42 v107.31,205.1
  Top 0.406: HALL_SENSE.2 72.39,70.61 76.45,66.55 77.22,66.55 78.23,65.53 78.23,25.4 73.15,20.57 73.15,18.03 J1.J1-12 | 100.33,204.47 MOTOR_PREDRIVER.27
  Bottom 0.305: HALL_MCU.2 62.23,161.29 67.31,167 81.28,167 90.17,173.35 90.17,200.03 95.25,204.47 MOTOR_PREDRIVER.27 | v107.31,205.1 113.67,205.1 114.3,205.74 HALL_SENSOR.3
HC  (via drill 0.6)  (1 unrouted)
  Top 0.305: MOTOR_PREDRIVER.28 102.87,210.82 R19.2 106.05,210.82 v104.78,212.09 | v110.49,217.17 114.3,217.17 116.84,219.71 HALL_SENSOR.2
  Bottom 0.305: HALL_MCU.1 59.69,161.29 66.04,167.64 80.64,167.64 89.53,173.99 89.53,201.29 95.89,207.01 MOTOR_PREDRIVER.28 | v104.78,212.09 106.68,212.09 110.49,215.9 v110.49,217.17
MEAS_CELL_A  (1 unrouted)
  Top 0.305: 55.88,91.44 BMS.2 53.98,94.61 29.84,94.61 26.99,91.76 R25.2
  Top 0.406: BATT_SENSE1.4 58.42,68.58 68.07,68.58 J1.J4-2 | R26.1 R25.2
MEAS_CELL_B  (via drill 0.6)  (1 unrouted)
  Top 0.305: v27.94,95.25 57.15,95.25 58.42,93.98 BMS.3
  Top 0.406: BATT_SENSE1.3 59.69,69.85 69.34,69.85 J1.J4-4 | R27.2 R28.1 v22.86,95.89
  Bottom 0.305: 58.42,93.98 BMS.3 | v22.86,95.89 27.3,95.89 v27.94,95.25
MEAS_CELL_C  (1 unrouted)
  Top 0.305: R29.2 29.21,106.36 | 29.21,106.36 29.53,106.36 | 29.21,106.36 32.07,106.36 41.91,96.52 58.42,96.52 60.96,93.98 BMS.4
  Top 0.406: BATT_SENSE1.2 60.96,71.12 70.61,71.12 J1.J4-6 | R29.2 21.27,106.36 19.05,104.14 16.83,104.14 R30.1
MOTOR_PWM
  Top 0.406: ESTOP.1 10.16,73.66 13.97,78.74 83.82,78.74 MOTOR_CNTRL1.2
N$1
  Top 0.406: 5VREGULATOR1.6 48.58,112.71 R20.1 55.88,112.71 R21.1
N$2  (7 unrouted)
N$4
  Top 0.406: 12.7,128.88 Q7.G
  Top 1.27: S1.2 13.97,116.84 12.7,118.11 12.7,128.88
N$6  (1 unrouted)
N$7  (1 unrouted)
N$12
  Top 0.406: C25.1 42.86,117.16 5VREGULATOR1.3
N$13  (7 unrouted)
N$22  (7 unrouted)
N$26  (7 unrouted)
N$27
  Top 0.406: D1.C 52.7,128.91 5VREGULATOR1.1 42.86,119.06 C25.2 | D1.C 54.61,130.81 | D1.C 55.88,130.81 68.58,118.11 L1.P$1
N$32  (1 unrouted)
N$35
  Top 0.305: MOTOR_PREDRIVER.14 77.79,173.99 C6.1
N$38  (via drill 0.6)
  Top 0.305: v61.59,182.25 62.23,181.61 R4.2
  Top 0.61: 43.18,184.15 Q6.1 | 43.18,184.15 40.96,184.15 R8.1 | v43.81,186.06 43.18,185.42 43.18,184.15
  Bottom 0.305: v43.81,186.06 44.45,185.42 58.42,185.42 v61.59,182.25
N$39  (via drill 0.6)
  Top 0.305: v43.81,216.53 43.18,215.9 43.18,214.63 | v60.96,208.28 60.96,204.47 63.5,201.93 R6.2
  Top 0.61: Q2.1 43.18,214.63 40.96,214.63 R9.2
  Bottom 0.305: v43.81,216.53 44.45,217.17 58.42,217.17 60.96,214.63 v60.96,208.28
N$40  (via drill 0.6)
  Top 0.254: R5.2 67.63,195.58 R13.1
  Top 0.305: Q3.1 30.73,191.77 v40.64,191.77 | 63.82,197.17 R13.1
  Top 0.61: v63.5,196.85 63.82,197.17
  Bottom 0.305: v40.64,191.77 59.69,191.77 63.5,195.58 v63.5,196.85
N$41
  Top 0.406: SELECT.4 12.98,45.76 R31.2
N$42
  Top 0.406: UP.4 14,32.04 R23.2
N$43
  Top 0.406: DOWN.4 14.76,19.34 R22.2
N$46  (via drill 0.6)
  Top 0.305: 43.18,199.07 43.88,199.07 | v43.81,201.29 43.18,200.66 | v60.96,196.85 60.96,194.31 63.5,191.77 R3.2
  Top 0.61: R14.2 43.18,199.07 43.18,200.66 | 43.88,199.07 Q4.1
  Bottom 0.305: v43.81,201.29 44.45,201.93 58.42,201.93 60.96,199.39 v60.96,196.85
N$47  (via drill 0.6)
  Top 0.254: R7.2 67.63,184.15 R10.1
  Top 0.305: Q5.1 30.73,176.53 v40.64,176.53 | v63.5,185.42 63.82,185.74 R10.1
  Bottom 0.305: v40.64,176.53 59.69,176.53 63.5,180.34 v63.5,185.42
N$48
  Top 0.305: R24.2 104.14,182.88 100.33,186.69
  Top 0.406: 100.33,186.69 MOTOR_PREDRIVER.20
N$49
  Top 0.254: C3.1 99.38,174.31 MOTOR_PREDRIVER.15
N$50
  Top 0.254: MOTOR_PREDRIVER.16 106.36,176.53 C3.2
N$52  (via drill 0.6)
  Top 0.254: R11.2 66.36,205.74 R12.1
  Top 0.305: Q1.1 30.73,207.01 v40.64,207.01 | v63.5,205.74 63.82,206.06 R12.1
  Bottom 0.305: v40.64,207.01 41.91,205.74 v63.5,205.74
N$53
  Top 0.305: MOTOR_PREDRIVER.22 LED1.C
N$54
  Top 0.305: LED1.A 107.63,191.77 R15.2
PWM_SERVO  (1 unrouted)
  Top 0.254: MOTOR_CNTRL.5 87.63,161.29 91.44,163.83 97.79,163.83 SERVO.3
  Bottom 0.406: MOTOR_CNTRL1.5 80.01,73.66 83.82,69.85 83.82,68.58 80.77,65.53 80.77,27.94 | 80.77,27.94 80.77,27.69 | 80.77,27.94 80.77,25.4 75.69,20.32 75.69,17.78 J1.J1-8
RESET  (via drill 0.6)
  Top 0.406: RESET.3 26.55,65.65 26.55,65.67 v28.19,67.56
  Bottom 0.406: J1.J3-6 52.83,63.5 47.24,63.5 45.21,65.53 33.02,65.53 30.99,67.56 v28.19,67.56
RST_SCRN
  Top 0.406: SCREEN.3 51.82,5.84 55.37,9.4 J1.J2-8
SA
  Top 0.254: C8.1 77.79,179.07
  Top 0.305: MOTOR_PREDRIVER.12 77.79,179.07 | Q6.2 44.2,175.51 45.72,173.99 68.58,173.99 73.66,179.07 77.15,179.07
  Top 0.406: 77.15,179.07 C8.1
  Top 0.61: C13.1 31.75,181.61 | R8.2 40.64,181.61 41.27,180.97
  Top 1.27: 12.7,179.07 13.34,179.07 | 13.34,179.07 13.34,178.44 22.86,178.44 22.86,184.78 13.34,184.78 13.34,179.07
  Top 1.778: 43.18,179.07 Q6.2 | 31.75,181.61 31.11,180.97
  Top 1.93: 43.18,179.07 41.27,180.97 31.11,180.97 | 31.75,181.61 21.59,181.61
  pour Top: 2.54,191.77 11.43,191.77 15.24,187.96 23.5,187.96 23.5,176.53 9.53,176.53 9.53,182.88 2.54,182.88
SB  (via drill 0.6)
  Top 0.254: MOTOR_PREDRIVER.8 79.06,189.23 C9.1
  Top 0.305: v62.23,189.87 73.03,189.87 | 73.66,189.23 78.42,189.23
  Top 0.406: 22.55,197.17 22.23,196.85 | Q4.2 44.2,190.75 v44.45,190.5 | 73.03,189.87 73.66,189.23 | 78.42,189.23 C9.1
  Top 0.61: 43.5,194.31 Q4.2 | R14.1 40.64,196.85 41.27,196.22
  Top 1.016: Q3.3 19.68,196.85 22.86,200.03
  Top 1.27: 17.78,200.66 13.34,200.66 13.34,193.68 22.86,193.68 22.86,200.03 18.41,200.03
  Top 1.778: 21.91,196.53 21.59,196.85 | Q4.2 43.18,194.31 | 32.07,196.22 C11.1
  Top 1.93: C11.1 21.91,196.53 | 43.18,194.31 41.27,196.22 32.07,196.22
  Bottom 0.305: v44.45,190.5 61.59,190.5
  Bottom 0.406: 61.59,190.5 v62.23,189.87
  pour Top: 2.54,199.39 11.43,199.39 13.97,201.93 23.5,201.93 23.5,191.77 13.97,191.77 11.43,194.31 2.54,194.31
SC  (via drill 0.6)
  Top 0.254: MOTOR_PREDRIVER.4 79.06,199.39 C10.1
  Top 0.305: v62.23,200.66 64.14,200.66 64.77,201.29 73.66,201.29 75.56,199.39 78.42,199.39
  Top 0.406: R9.1 40.64,211.84 40.7,211.78 | 33.66,211.78 C12.1 | 21.91,211.78 21.59,212.09 | Q2.2 44.45,209.55 v44.45,204.47 | 78.42,199.39 C10.1
  Top 1.27: 12.7,215.9 13.34,215.9 13.34,208.91 22.86,208.91 22.86,215.9 13.97,215.9 13.97,215.26
  Top 1.93: Q2.2 40.7,211.78 33.66,211.78 21.91,211.78
  Bottom 0.305: v44.45,204.47 58.42,204.47 v62.23,200.66
  pour Top: 2.54,201.93 11.43,201.93 15.88,205.74 23.5,205.74 23.5,216.53 8.89,216.53 8.89,209.55 2.54,209.55
SELECT
  Top 0.406: SELECT.3 3.93,44.33 6.35,41.91 39.88,41.91 59.18,22.61 59.18,17.78 J1.J2-4
SI_CAM1
  Top 0.406: CAMERA1.4 84.84,16.26 J1.J1-2
SI_CAM2
  Top 0.406: CAMERA2.4 69.6,16.26 J1.J1-14
TEMP  (via drill 0.6)  (1 unrouted)
  Top 0.305: v68.58,168.91 68.58,161.29 HALL_MCU.4
  Bottom 0.305: HALL_SENSOR.5 109.22,215.9 106.68,213.36 83.82,213.36 80.01,209.55 80.01,170.18 78.74,168.91 v68.58,168.91
UP
  Top 0.406: UP.3 3.93,30.36 6.35,27.94 49.02,27.94 56.64,20.32 56.64,17.78 J1.J2-6
VBB  (3 unrouted)
  Top 0.254: C1.+ 99.06,212.09 95.25,208.28 95.25,184.15 97.79,181.61 MOTOR_PREDRIVER.18
  Top 0.305: MOTOR_PREDRIVER.18 101.6,179.07 105.41,179.07
  Top 0.406: 5VREGULATOR1.2 50.8,120.65 C24.1
  Top 0.61: 25.4,119.38 26.04,119.38 28.57,119.38 28.57,116.84 26.04,116.84 | 25.4,124.46 26.04,124.46 28.57,124.46 28.57,121.92 26.04,121.92 | 25.4,114.3 26.04,114.3 28.57,114.3 28.57,111.76 26.04,111.76
  Top 0.813: 26.04,116.84 26.04,119.38 | 26.04,121.92 26.04,124.46 | 26.04,111.76 26.04,114.3
  Top 1.016: 59.05,178.44 59.05,184.78 | Q6.3 54.3,182.57 55.88,184.15 55.88,184.78 | Q4.3 55.88,196.85 59.05,200.03 | Q2.3 53.34,212.09 49.53,208.28 50.49,208.28 Q2.3
  Top 1.27: 49.53,208.91 49.53,208.28 59.05,208.28 59.05,215.26 49.53,215.26 49.53,209.55 | 49.53,177.8 49.53,178.44 | 49.53,178.44 59.05,178.44 | 59.05,184.78 55.88,184.78 49.53,184.78 49.53,178.44 | 49.53,193.04 59.05,193.04 59.05,200.03 49.53,200.03 49.53,193.04
  Top 2.54: 67.31,226.06 76.2,217.17 C2.+ C1.+
  pour Top: 33.66,151.13 33.66,134.62 29.21,134.62 29.21,111.12 24.13,111.12 24.13,119.38 -1.27,119.38 -1.27,120.65 -2.54,120.65 -2.54,149.86
  pour Top: 28.57,111.76 24.13,111.76 24.13,107.31 40.01,107.31 40.01,108.58 50.8,108.58 50.8,123.19 45.72,123.19 45.72,115.57 36.83,115.57 36.83,109.86 28.57,109.86
  pour Top: 72.39,229.87 48.9,229.87 48.9,176.53 59.69,176.53 59.69,217.81 74.3,217.81 72.39,220.98
VDD  (3 unrouted)
  Top 0.254: MOTOR_PREDRIVER.19 97.79,184.15 96.52,185.42 96.52,187.96 97.79,189.23 96.52,190.5 96.52,208.28 101.28,213.04
  Top 0.305: R35.1 R34.1 R19.1 109.22,211.14 | 101.28,213.04 107.95,213.04 108.27,213.04 | 105.41,185.42 101.6,189.23 MOTOR_PREDRIVER.21 | R15.1 106.36,188.91 105.41,187.96 105.41,185.74 | 119.38,181.61 CONN3.PIN2
  Top 0.406: C26.+ R20.2 | 31.1 84.14,108.27 3.3V_REGULATOR.IN | 108.27,213.04 109.22,212.09 109.22,211.14 | 105.41,185.42 C5.1 105.41,185.74 | R19.1 115.57,210.82 119.38,207.01 CONN3.PIN2 | 107.95,213.04 107.95,224.79 HALL_SENSOR.6
  Top 1.016: SERVO.2 99.06,158.75 100.33,157.48 109.22,157.48 116.84,163.83 116.84,168.91 118.11,170.18 121.92,170.18 123.19,171.45 123.19,179.07 120.65,181.61 119.51,181.61
  Top 1.778: C27.+ C26.+ 62.99,105.92 66.04,102.87 71.12,102.87 L1.P$2
  Bottom 1.27: C27.+ 39.37,103.38 39.37,100.33 44.45,95.25 MCU_PWR.2
  Bottom 1.778: L1.P$2 3.3V_REGULATOR.IN 91.44,107.95 95.25,111.76 116.97,111.76 CONN2.PIN2

### Text on the board
Dimension: EE192 Team 1 / Chris Berthelet / Nick Crispie / David Hooper | EE192 Team 1 / Chris Berthelet / Nick Crispie / David Hooper
tNames: EE192 Team 1 / Chris Berthelet / Nick Crispie / David Hooper